# Altium schematic sheet MCU_F103RB.SchDoc
size A4; SheetNumber: 1; SheetTotal: 3
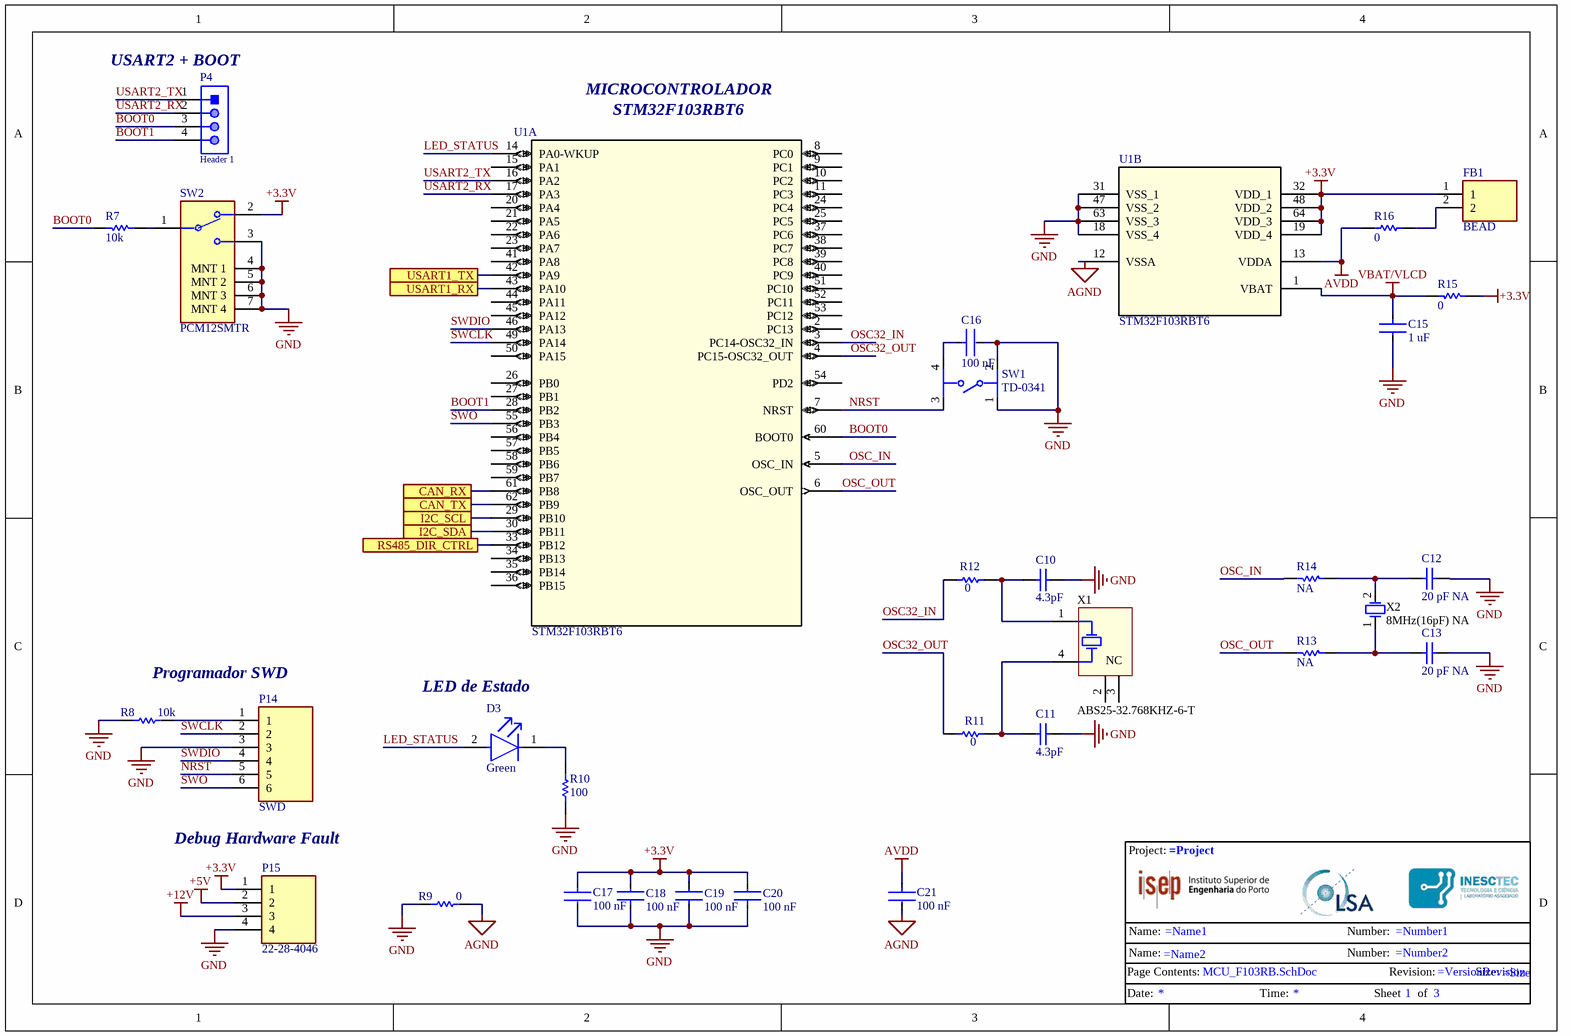
[diagram p0: MCU_F103RB.SchDoc]

## Parts
?  Title_Block  (value not drawn)  (graphical)
C10  4.3pF  [CAPC1608X90X35LL10T15]
C11  4.3pF  [CAPC1608X90X35LL10T15]
C12  20 pF NA  [CAPC1608X90X35NL15T15]
C13  20 pF NA  [CAPC1608X90X35NL15T15]
C15  1 uF  [FP-CC0603-DA-MFG]
C16  100 nF  [FP-CC0603-DA-MFG]
C17  100 nF  [FP-CC0603-DA-MFG]
C18  100 nF  [FP-CC0603-DA-MFG]
C19  100 nF  [FP-CC0603-DA-MFG]
C20  100 nF  [FP-CC0603-DA-MFG]
C21  100 nF  [FP-CC0603-DA-MFG]
D3  Green  [FP-6_541-5056_01-4-MFG]
FB1  BEAD  [BEADC1608X95N]
P4  Header 1  [61300411121]
P14  SWD  [HDRV6W30P0X127_1X6_762X210X430P]
P15  22-28-4046  [HDRV4W66P0X254_1X4_1016X249X838P]
R7  10k  [RESC1608X55X25ML10T15]
R8  10k  [RESC1608X55X25ML10T15]
R9  0  [RESC1608X55X25ML10T15]
R10  100  [RESC1608X55X30ML20T20]
R11  0  [RESC1608X55X25ML10T15]
R12  0  [RESC1608X55X25ML10T15]
R13  NA  [RESC1608X55X25ML10T15]
R14  NA  [RESC1608X55X25ML10T15]
R15  0  [RESC1608X55X25ML10T15]
R16  0  [RESC1608X55X25ML10T15]
SW1  TD-0341  [FP-1571563-9-MFG]
SW2  PCM12SMTR  [FP-PCM12SMTR-MFG]
U1  STM32F103RBT6  [LQFP64-10x10mm]  (parts A,B of 2)
X1  ABS25-32.768KHZ-6-T  [ABRA-ABS25-4_V]
X2  8MHz(16pF) NA  [FOX-FOXSLF160-20]

## Ports
CAN_RX, CAN_TX, I2C_SCL, I2C_SDA, RS485_DIR_CTRL, USART1_RX, USART1_TX

## Nets
+3.3V: C17.1 C18.2 C19.2 C20.2 FB1.1 P15.1 R15.1 SW2.2 U1.19(VDD_4) U1.32(VDD_1) U1.48(VDD_2) U1.64(VDD_3)
+5V: P15.2
+12V: P15.3
AGND: C21.2 R9.2 U1.12(VSSA)
AVDD: C21.1 R16.2 U1.13(VDDA)
GND: C10.2 C11.2 C12.1 C13.1 C15.2 C16.2 C17.2 C18.1 C19.1 C20.1 P14.3 P15.4 R8.1 R9.1 R10.1 SW1.1 SW1.2 SW2.3 SW2.4(MNT_1) SW2.5(MNT_2) SW2.6(MNT_3) SW2.7(MNT_4) U1.18(VSS_4) U1.31(VSS_1) U1.47(VSS_2) U1.63(VSS_3)
VBAT/VLCD: C15.1 R15.2 U1.1(VBAT)
BOOT0: P4.3 R7.2 U1.60(BOOT0)
BOOT1: P4.4 U1.28(PB2)
CAN_RX: U1.61(PB8) ; port CAN_RX
CAN_TX: U1.62(PB9) ; port CAN_TX
I2C_SCL: U1.29(PB10) ; port I2C_SCL
I2C_SDA: U1.30(PB11) ; port I2C_SDA
LED_STATUS: D3.2(A) U1.14(PA0-WKUP)
NRST: P14.5 SW1.3 U1.7(NRST)
OSC32_IN: R12.1 U1.3(PC14-OSC32_IN)
OSC32_OUT: R11.1 U1.4(PC15-OSC32_OUT)
OSC_IN: R14.2 U1.5(OSC_IN)
OSC_OUT: R13.2 U1.6(OSC_OUT)
RS485_DIR_CTRL: U1.33(PB12) ; port RS485_DIR_CTRL
SWCLK: P14.2 U1.49(PA14)
SWDIO: P14.4 U1.46(PA13)
SWO: P14.6 U1.55(PB3)
USART1_RX: U1.43(PA10) ; port USART1_RX
USART1_TX: U1.42(PA9) ; port USART1_TX
USART2_RX: P4.2 U1.17(PA3)
USART2_TX: P4.1 U1.16(PA2)
NetC10_1: C10.1 R12.2 X1.1(X1)
NetC11_1: C11.1 R11.2 X1.4(X2)
NetC12_2: C12.2 R14.1 X2.2
NetC13_2: C13.2 R13.1 X2.1
NetC16_1: C16.1 SW1.4
NetD3_1: D3.1(C) R10.2
NetFB1_2: FB1.2 R16.1
NetP14_1: P14.1 R8.2
NetR7_1: R7.1 SW2.1

Not connected (* = marked no-connect by the designer): U1 2(PC13) 8(PC0) 9(PC1) 10(PC2) 11(PC3) 15(PA1) 20(PA4) 21(PA5) 22(PA6) 23(PA7) 24(PC4) 25(PC5) 26(PB0) 27(PB1) 34(PB13) 35(PB14) 36(PB15) 37(PC6) 38(PC7) 39(PC8) 40(PC9) 41(PA8) 44(PA11) 45(PA12) 50(PA15) 51(PC10) 52(PC11) 53(PC12) 54(PD2) 56(PB4) 57(PB5) 58(PB6) 59(PB7); X1 2(NC) 3(NC)

## Notes on the sheet
- (near P4) USART2 + BOOT
- MICROCONTROLADOR
- (near U1) STM32F103RBT6
- Programador SWD
- (near D3) LED de Estado
- Debug Hardware Fault
- (in symbol Title_Block) Project:; Name:; Number:; Page Contents:; Revision:; Size:; Date:; Time:; Sheet; of

## Library data of the parts
C10 C11 = CMP-2006-02448-1: 0603; Part Number: GQM1885C2A4R3BB01D; Manufacturer: Murata
C12 C13 = CMP-2006-04264-1: Part Number: 06035A200JAT2A; Manufacturer: AVX Interconnect / Elco
C15 = CMP-1035-02737-2: CAP CER 1UF 16V X5R 0603; Manufacturer Part Number: CC0603KRX5R7BB105; Manufacturer: YAGEO; Material: Ceramic; Temperature Coefficient: 15%; Tolerance: 0.1; Digikey Description: CAP CER 1UF 16V X5R 0603; Category: Cap; Automotive: No; Octopart: https://octopart.com/cc0603krx5r7bb105-yageo-8376530; Voltage Rating: 16 V; Device Class L3: Ceramic Capacitors; Value: 1 uF; Temperature Characteristic: X5R; Voltage: 16 V; RoHS: TRUE; Lead Free: Yes; Temperature: -55°C to +125°C; Device Class L2: Capacitors; ComponentLink2URL: http://www.yageo.com/documents/recent/UPY-GPHC_X7R_6.3V-to-50V_18.pdf; Capacitance: 1 uF; Footprint Url: http://www.yageo.com/exep/pages/download/literatures/UPY-C_GEN_24.pdf; Height: 0.9mm; ComponentLink2Description: Datasheet; Temperature Range High: +125°C; Mouser Description: Multilayer Ceramic Capacitors MLCC - SMD/SMT 1.0uF 16V X5R 10%; Package: CC0603-DA; Device Class L1: Passive Components; Temperature Range Low: -55°C
C16-C21 = CMP-2100-03601-2: CAP CER 0.1UF 50V X7R 0603; Manufacturer: YAGEO; Manufacturer Part Number: CC0603KRX7R9BB104; Material: Ceramic; Temperature Coefficient: 15%; Tolerance: 0.1; Height: 0.9mm; Voltage: 50 V; ComponentLink2Description: Datasheet; Device Class L2: Capacitors; Temperature Range High: +125°C; Category: Cap; Capacitance: 100 nF; Footprint Url: http://www.yageo.com/exep/pages/download/literatures/UPY-C_GEN_24.pdf; ComponentLink2URL: http://www.yageo.com/documents/recent/UPY-GPHC_X7R_6.3V-to-50V_18.pdf; Package: CC0603-DA; Temperature: -55°C to +125°C; Voltage Rating: 50 V; Temperature Characteristic: X7R; Device Class L1: Passive Components; Temperature Range Low: -55°C; RoHS: TRUE; Automotive: No; Value: 100 nF; Device Class L3: Ceramic Capacitors; Octopart: https://octopart.com/cc0603krx7r9bb104-yageo-42244635; Mouser Description: Multilayer Ceramic Capacitor, CC Series, 0.1 - F, - 10%, X7R, 50 V, 0603 [1608 Metric]; Lead Free: Yes; Digikey Description: CAP CER 0.1UF 50V X7R 0603
D3 = CMP-02520-000009-1: LED GREEN 0603 SMD; Manufacturer Part Number: TLMP1100-GS08; Manufacturer: Vishay; Max Junction Temp: +120°C; Automotive Grade: Grade 3; Reverse Voltage: 6V; Led Orientation: Top View; Forward Voltage: 2.1V; Luminous Intensity: 15mcd; Forward Current: 20mA; Colour: Pure green; Peak Emmision Wavelength: 562nm; Wavelength: 561nm; Viewing Angle: 160°; Power Dissipation: 90mW; Digikey Description: LED GREEN 0603 SMD; Package: 6.541-5056.01-4; Ambient Temperature Range High: +100°C; Height: 0.65mm; Device Class L1: Optoelectronics; Device Class L2: LEDs; Mouser Description: Standard LEDs - SMD Pure Green; Temperature Range High: +120°C; RoHS: TRUE; Ambient Temperature Range Low: -40°C; Temperature: to +120°C; ComponentLink2URL: http://www.vishay.com/docs/83173/tlmb1100.pdf; Lead Free: Yes; Octopart: https://octopart.com/tlmp1100-gs08-vishay-55433993; Automotive: Yes; Device Class L3: unset; ComponentLink2Description: Datasheet; Category: Diode
FB1 = MMZ1608S601ATD25: Ferrite Bead; Manufacturer_Name: TDK; Datasheet Link: https://datasheet.datasheetarchive.com/originals/dk/DKDS-25/489214.pdf; Height: 0.95mm; Manufacturer_Part_Number: MMZ1608S601ATD25; Mouser Part Number: 810-MMZ1608S601ATD25; Mouser Price/Stock: https://www.mouser.co.uk/ProductDetail/TDK/MMZ1608S601ATD25?qs=pvNC7ksEVIeMnkuqWHgErw%3D%3D; Arrow Part Number: MMZ1608S601ATD25; Arrow Price/Stock: https://www.arrow.com/en/products/mmz1608s601atd25/tdk
P4 = CMP-1502-01064-1: THT Vertical Pin Header WR-PHD, Pitch 2.54 mm, Single Row, 4 pins; Manufacturer: Wurth Elektronik; Withstanding Voltage: 500VAC; Rated Current: 3A; Working Voltage: 250VAC; Pin Number: 4; Gender: Male; Contact Resistance: 20mOhm; Pitch: 2.54mm; Manufacturer URL: http://www.we-online.de; Operating Temperature: -40to105degC; Packaging: Bag; Mounting Technology: THT; Package Reference: 61300411121; Datasheet URL: https://katalog.we-online.de/em/datasheet/6130xx11121.pdf; Publisher: WurthElektronik; Part Number: 61300411121; Row Number: Single; Orientation: Vertical
P14 = M50-3530642: Connector; Manufacturer_Name: Harwin; Datasheet Link: https://cdn.harwin.com/pdfs/M50-353.pdf; Height: 4.3mm; Manufacturer_Part_Number: M50-3530642; Mouser Part Number: 855-M50-3530642; Mouser Price/Stock: https://www.mouser.co.uk/ProductDetail/Harwin/M50-3530642?qs=%252BdQmOuGyFcHPs2UJx%2F79Cg%3D%3D
P15 = 22-28-4046: Connector; Manufacturer_Name: Molex; Datasheet Link: https://componentsearchengine.com/Datasheets/1/22-28-4046.pdf; Height: 8.38mm; Manufacturer_Part_Number: 22-28-4046; Mouser Part Number: 538-22-28-4046; Mouser Price/Stock: https://www.mouser.co.uk/ProductDetail/Molex/22-28-4046?qs=GAPJcf4kvdtZsXSzVDpHFw%3D%3D
R7 R8 = CMP-2000-05022-1: Resistor, 10 kOhm, +/- 5%, 100 mW, -55 to 155 degC, 0603 (1608 Metric), RoHS, Tape and Reel; Manufacturer: Yageo; Resistance: 10kOhms; Voltage Rating: 50V; Temperature Coefficient: 100PPM/C; Power Rating: 100mW; Package Reference: 603; Series: RC; Case Code - mm: 1608; Packaging: Reel; Datasheet URL: http://www.farnell.com/datasheets/443971.pdf; Datasheet Version: Rev. 4, 04/2009; Operating Temperature Range: -55Cto+155C; Product: ThickFilmResistorsGeneralPurpose; Package Description: 2-Pin Surface Mount Device, Body 1.6 x 0.8 mm; Manufacturer URL: http://www.yageo.com/; Case Code - in: 0603; Tolerance: 5%; Termination Style: SMD/SMT
R9 R11-R16 = CMP-2100-03667-1: Chip Resistor, 0 Ohm, +/- 5%, 0.1 W, -55 to 155 degC, 0603 (1608 Metric), RoHS, Tape and Reel; Manufacturer: Yageo; Temperature Coefficient: 200ppm/degreesC; Voltage Rating: 50V; Power Rating: 100mW; Resistance: 0mOhm; Width: 0.8mm; Max Operating Temperature: 155degC; Tolerance: 5%; Package Reference: 0603; Height: 0.45mm; Depth: 0.8mm; Package Description: 2-Pin Surface Mount Device, Body 1.6 x 0.8 mm; Termination: SMD/SMT; Package Quantity: 5000; Case/Package: 0603; Case Code (Imperial): 0603; Radiation Hardening: No; Number of Pins: 2; Length: 1.6mm; Lead Free: LeadFree; Voltage Rating (DC): 50V; Military Standard: Not; Datasheet URL: http://www.yageo.com/NewPortal/yageodocoutput?fileName=/pdf/R-Chip/PYu-RC_Group_51_RoHS_L_5.pdf; Manufacturer URL: http://www.yageo.com/; Packaging: TapeandReel; Case Code (Metric): 1608; Min Operating Temperature: -55degC; Composition: ThickFilm; RoHSCompliant: true; Contact Plating: Tin; Datasheet Version: Rev. 5, 10/2016; REACH SVHC: NoSVHC
R10 = CMP-2000-00897-1: Manufacturer: Panasonic; Part Number: ERA3AEB122V
SW1 = CMP-03402-000005-1: SWITCH TACTILE SPST-NO 0.05A 24V; Manufacturer: TE Connectivity; Manufacturer Part Number: 1571563-9; Standoff Height: 0.05mm; Electromechanical Life: 100000Cycles; Contact Resistance: 100mΩ; Operating Force: 160gf; Contact Current Rating: 50mA; Automotive: No; Device Class L1: Electromechanical; Voltage Rating Dc: 24V; ComponentLink2Description: Datasheet; Mount: Surface Mount; RoHS: TRUE; Temperature: -35°C to +85°C; ComponentLink2URL: https://www.te.com/commerce/DocumentDelivery/DDEController?Action=showdoc&DocId=Customer+Drawing%7F2-1437565-7%7FV%7Fpdf%7FEnglish%7FENG_CD_2-1437565-7_V.pdf%7F1571563-9; Temperature Range Low: -35°C; Lead Free: Yes; Device Class L2: Switches; Package: SMT_SW_6MM0_6MM0; Octopart: https://octopart.com/1571563-9-te+connectivity-41253969; Throw Configuration: SPST-NO; Mouser Description: Tactile Switches SPST OFF(ON) RND SMT MINI PB TACT SWITCH; Temperature Range High: +85°C; Digikey Description: SWITCH TACTILE SPST-NO 0.05A 24V; Device Class L3: Pushbutton Switches; Category: Switch; Height: 9.75mm
SW2 = CMP-2000-06884-2: SWITCH SLIDE SPDT 300MA 6V; Actuator Material: Nylon; Switch Function: On-On; Insulation Resistance: 100mR; Actuator Type: Standard; Mechanical Life: 10000Cycles; Actuator Length: 1.5mm; Contact Resistance: 70mR; Min Operating Temperature: -20°C; Max Current Rating: 300mA; Max Voltage Rating (DC): 6V; Package Quantity: 1; Mount: Surface Mount; Packaging: Tape and Reel; Contact Plating: Silver; Depth: 5mm; REACH SVHC: No SVHC; Voltage Rating (DC): 6V; Voltage Rating (AC): 6V; Max Operating Temperature: 85°C; Length: 7.7mm; Termination: Gull Wing; Current Rating: 300mA; Contact Current Rating: 300mA; Orientation: Right Angle; Width: 6.7mm; Switch Travel: 1.5mm; Lead Free: Lead Free; Contact Material: Copper Alloy; Throw Configuration: SPDT
U1 = STM32F103RBT6: No Description Available; Mfr_Name: STMicroelectronics; Copyright: Copyright (C) 2021 Ultra Librarian. All rights reserved.; Manufacturer_Part_Number: STM32F103RBT6; RefDes: RefDes; Type: DEV
X1 = CMP-2000-05036-1: Low Frequency Crystal, 32.768 KHz, 6 pF, +/- 20 ppm, -40 to 85 degC, 4-Pin SMD, RoHS, Tape and Reel; Manufacturer: Abracon; Tolerance: 20PPM; ESR: 50kOhms; Case Width: 3.8mm; Case Height: 2.5mm; Case Length: 8mm; Load Capacitance: 6pF; Operating Temperature Range: -40Cto+85C; Package Reference: ABS25; Factory Pack Quantity: 3000; Package Description: 4-Pin Surface Mount Device, Body 8 x 3.8 mm, Pitch 5.5 mm; Frequency: 32.768kHz; Termination Style: SMD/SMT; Manufacturer URL: http://www.abracon.com/; Type: LowFrequencyCrystal; Dimensions: 3.8mmWx8mmLx2.5mmH; Product Category: Crystals; Series: ABS25; RoHS: Details; Package / Case: 8mmx3.8mm; Datasheet Version: Jun-17; Brand: ABRACON; Datasheet URL: https://datasheet.ciiva.com/854/abs25-854528.pdf; Packaging: Reel; Mounting Style: SMD/SMT
X2 = CMP-1749-00003-1: Resistance Weld Thru-Hole Crystal, 16 MHz, -20 to 70 degC, 2-Pin THD, RoHS, Bulk; Voltage Rating: 250 V; Tolerance: 1%; Resistance: 221 kohm; Case\Package: Axial; Power Rating: 250 mW; RoHSCompliant: true; Package Quantity: 200; Packaging: Bulk; Min Operating Temperature: -55 degC; DatasheetVersion: Mar-15; ComponentLink1URL: http://www.foxonline.com/; Max Operating Temperature: 155 degC; PackageReference: FOXSLF160-20; Mount: Through Hole; PackageDescription: 2-Pin Through Hole Device, Body 11.35 x 4.65 mm; ComponentLink1Description: Manufacturer URL; ComponentLink2URL: http://www.foxonline.com/pdfs/hc49slf.pdf; ComponentLink2Description: Datasheet; Length: 0.248 inch